# EAGLE design cropdroid-reservoir (EAGLE 9.7.0)
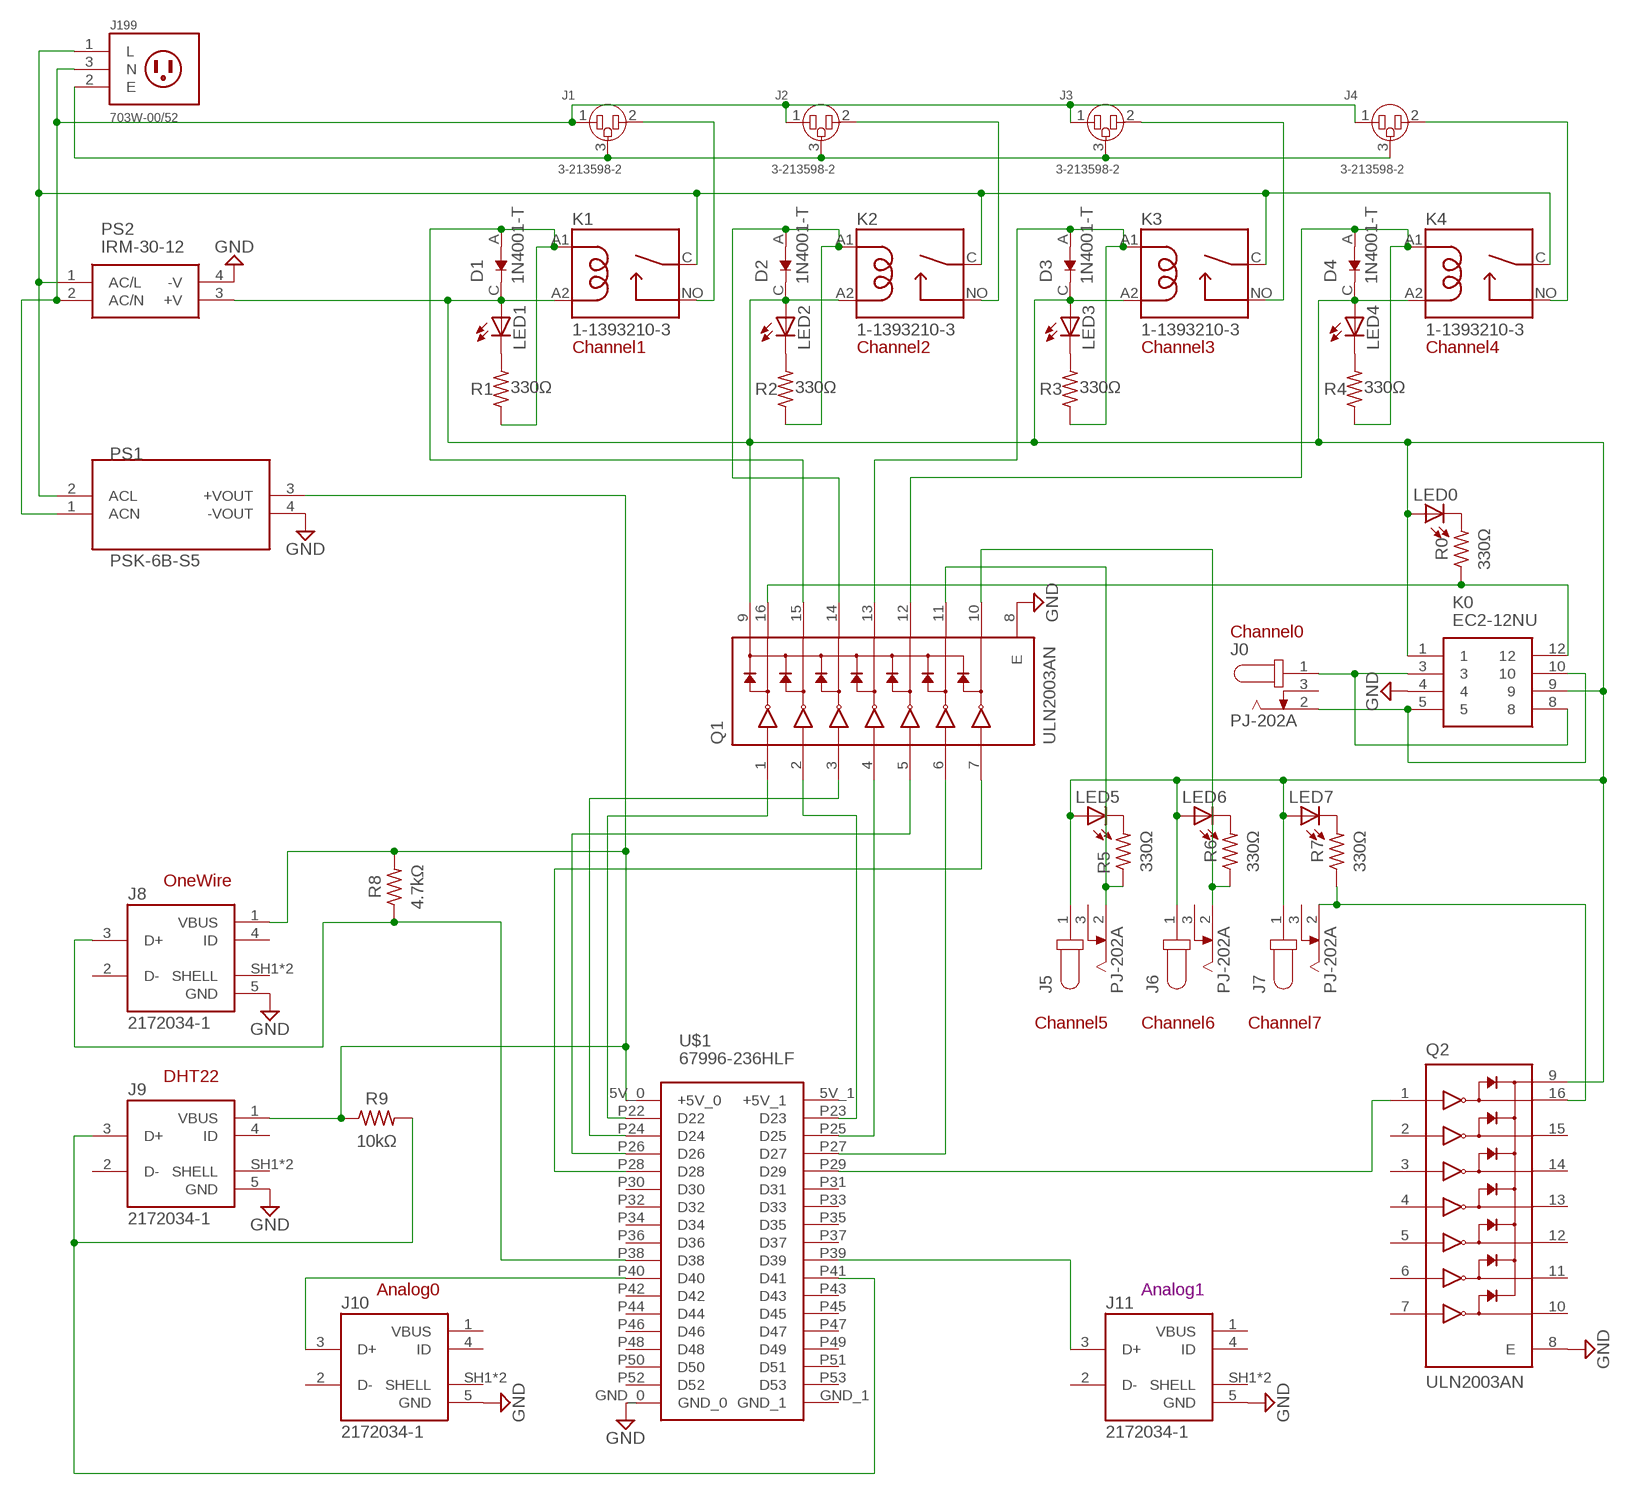
[diagram p0: schematic, sheet 1]

## Parts
D1  1N4001-T  [DIOAD953W69L521D272]
D2  1N4001-T  [DIOAD953W69L521D272]
D3  1N4001-T  [DIOAD953W69L521D272]
D4  1N4001-T  [DIOAD953W69L521D272]
J0  PJ-202A  [CUI_PJ-202A]
J1  3-213598-2  [TE_3-213598-2]
J2  3-213598-2  [TE_3-213598-2]
J3  3-213598-2  [TE_3-213598-2]
J4  3-213598-2  [TE_3-213598-2]
J5  PJ-202A  [CUI_PJ-202A]
J6  PJ-202A  [CUI_PJ-202A]
J7  PJ-202A  [CUI_PJ-202A]
J8  2172034-1  [TE_2172034-1]
J9  2172034-1  [TE_2172034-1]
J10  2172034-1  [TE_2172034-1]
J11  2172034-1  [TE_2172034-1]
J199  703W-00/52  [QUALTEK_703W-00/52]
K0  EC2-12NU  [EC2-12NU]
K1  1-1393210-3  [TE_1-1393210-3]
K2  1-1393210-3  [TE_1-1393210-3]
K3  1-1393210-3  [TE_1-1393210-3]
K4  1-1393210-3  [TE_1-1393210-3]
LED0  LED3MM  [LED3MM]
LED1  LED3MM  [LED3MM]
LED2  LED3MM  [LED3MM]
LED3  LED3MM  [LED3MM]
LED4  LED3MM  [LED3MM]
LED5  LED3MM  [LED3MM]
LED6  LED3MM  [LED3MM]
LED7  LED3MM  [LED3MM]
PS1  PSK-6B-S5  [CONV_PSK-6B-S5]
PS2  IRM-30-12  [IRM3048]
Q1  ULN2003AN  [DIP794W45P254L1969H508Q16]
Q2  ULN2003AN  [DIP794W45P254L1969H508Q16]
R0  330Ω  R-US_AXIAL-7.2MM-PITCH  [RESAD724W46L381D178B]
R1  330Ω  R-US_AXIAL-7.2MM-PITCH  [RESAD724W46L381D178B]
R2  330Ω  R-US_AXIAL-7.2MM-PITCH  [RESAD724W46L381D178B]
R3  330Ω  R-US_AXIAL-7.2MM-PITCH  [RESAD724W46L381D178B]
R4  330Ω  R-US_AXIAL-7.2MM-PITCH  [RESAD724W46L381D178B]
R5  330Ω  R-US_AXIAL-7.2MM-PITCH  [RESAD724W46L381D178B]
R6  330Ω  R-US_AXIAL-7.2MM-PITCH  [RESAD724W46L381D178B]
R7  330Ω  R-US_AXIAL-7.2MM-PITCH  [RESAD724W46L381D178B]
R8  4.7kΩ  R-US_AXIAL-7.2MM-PITCH  [RESAD724W46L381D178B]
R9  10kΩ  R-US_AXIAL-7.2MM-PITCH  [RESAD724W46L381D178B]
U$1  67996-236HLF  [67996-236HLF]

## Nets
GND: J8.5(GND) J9.5(GND) J10.5(GND) J11.5(GND) K0.4 PS1.4(-VOUT) PS2.4(-V) Q1.8(E) Q2.8(E) U$1.GND_0
N$1 [PowerSupply]: J1.1 J2.1 J3.1 J4.1 J199.3(N) PS1.1(ACN) PS2.2(AC/N)
N$2: K0.12 Q1.16(1C) R0.1
N$3: LED1.K(C) R1.2
N$4: D1.A K1.A1 Q1.15(2C) R1.1
N$5 [MainsAC]: J1.2 K1.NO
N$6: J11.3(D+) U$1.P39(D39)
N$7 [MainsAC]: J1.3 J2.3 J3.3 J4.3 J199.2(E)
N$8: LED2.K(C) R2.2
N$9 [MainsAC]: J2.2 K2.NO
N$10: D2.A K2.A1 Q1.14(3C) R2.1
N$11 [PowerSupply]: D1.C D2.C D3.C D4.C J5.1 J6.1 J7.1 K0.1 K0.9 K1.A2 K2.A2 K3.A2 K4.A2 LED0.A LED1.A LED2.A LED3.A LED4.A LED5.A LED6.A LED7.A PS2.3(+V) Q1.9(COM) Q2.9(COM)
N$12: LED3.K(C) R3.2
N$13: J0.1 K0.3 K0.8
N$14: LED4.K(C) R4.2
N$15: J0.2 K0.5 K0.10
N$16: J5.2 Q1.11(6C) R5.1
N$17: D3.A K3.A1 Q1.13(4C) R3.1
N$18 [MainsAC]: J3.2 K3.NO
N$19: J6.2 Q1.10(7C) R6.1
N$20: D4.A K4.A1 Q1.12(5C) R4.1
N$21 [MainsAC]: J4.2 K4.NO
N$22: J7.2 Q2.16(1C) R7.1
N$23: Q2.1(1B) U$1.P29(D29)
N$24: Q1.6(6B) U$1.P27(D27)
N$25: Q1.4(4B) U$1.P25(D25)
N$26: Q1.2(2B) U$1.P23(D23)
N$27: J9.3(D+) R9.2 U$1.P41(D41)
N$29 [PowerSupply]: J199.1(L) K1.C K2.C K3.C K4.C PS1.2(ACL) PS2.1(AC/L)
N$30: Q1.1(1B) U$1.P22(D22)
N$31: Q1.3(3B) U$1.P24(D24)
N$32: J8.1(VBUS) J9.1(VBUS) PS1.3(+VOUT) R8.2 R9.1 U$1.5V_0(+5V_0)
N$33: J10.3(D+) U$1.P40(D40)
N$35: Q1.7(7B) U$1.P28(D28)
N$36: Q1.5(5B) U$1.P26(D26)
N$37: J8.3(D+) R8.1 U$1.P38(D38)
N$39: LED5.K(C) R5.2
N$40: LED6.K(C) R6.2
N$41: LED7.K(C) R7.2
N$42: LED0.K(C) R0.2
Unconnected: J0.3 J5.3 J6.3 J7.3 J8.2(D-) J8.4(ID) J9.2(D-) J9.4(ID) J10.2(D-) J10.4(ID) J11.2(D-) J11.4(ID) Q2.2(2B) Q2.3(3B) Q2.4(4B) Q2.5(5B) Q2.6(6B) Q2.7(7B) Q2.10(7C) Q2.11(6C) Q2.12(5C) Q2.13(4C) Q2.14(3C) Q2.15(2C) U$1.5V_1(+5V_1) U$1.GND_1 U$1.P30(D30) U$1.P31(D31) U$1.P32(D32) U$1.P33(D33) U$1.P34(D34) U$1.P35(D35) U$1.P36(D36) U$1.P37(D37) U$1.P42(D42) U$1.P43(D43) U$1.P44(D44) U$1.P45(D45) U$1.P46(D46) U$1.P47(D47) U$1.P48(D48) U$1.P49(D49) U$1.P50(D50) U$1.P51(D51) U$1.P52(D52) U$1.P53(D53)

## Notes on the sheet
- Channel1 | Channel1 | Channel2 | Channel3 | Channel4
- Channel0
- OneWire
- Channel5 | Channel6 | Channel7
- DHT22
- Analog0 | Analog1

## Power pins joined to a net without a drawn wire
SHELL: J8.SH1(SHELL) J8.SH2(SHELL) J9.SH1(SHELL) J9.SH2(SHELL) J10.SH1(SHELL) J10.SH2(SHELL) J11.SH1(SHELL) J11.SH2(SHELL)
VBUS: J10.1(VBUS) J11.1(VBUS)

## Library data of the parts
D1-D4 = 1N4001-T:1N4001-T: Diode, Standard Recovery, 1a, 50v, Do-204al-2, Full Reel Check prices <https://pricing.snapeda.com/parts/1N4001/ON%20Semiconductor/view-part?ref=eda>; AVAILABILITY: In Stock; DESCRIPTION: DIODE; 1 A (MAX.) @ 25C IF; 1.1 V (MAX.) @ 25C; 5 UADC (MAX.) @ 25C IR; MF: ON Semiconductor; MP: 1N4001; PACKAGE: DO-41 HVCA; PRICE: None
J0 J5-J7 = PJ-202A:PJ-202A: 2.0 mm Center Pin, 2.5 A, Right Angle, Through Hole, Kinked Pins, Dc Power Jack Connector Check prices <https://pricing.snapeda.com/parts/PJ-202A/CUI%20Devices/view-part?ref=eda>; AVAILABILITY: In Stock; CUI_PURCHASE_URL: https://www.cuidevices.com/product/interconnect/connectors/dc-power-connectors/jacks/pj-202a?utm_source=snapeda.com&utm_medium=referral&utm_campaign=snapedaBOM; DESCRIPTION: 2.0 x 6.5 mm, 2.5 A, Horizontal, Through Hole, Kinked Pins, Dc Power Jack Connector; MF: CUI Devices; MP: PJ-202A; PACKAGE: None; PRICE: None
J1-J4 = 3-213598-2:3-213598-2: Conn Power RCP 2Power/1Ground POS 12.7mm Solder ST Thru-Hole 3 Terminal 1 Port Check prices <https://pricing.snapeda.com/parts/3-213598-2/TE%20Connectivity/view-part?ref=eda>; AVAILABILITY: In Stock; COMMENT: 3-213598-2; DESCRIPTION: OUTLET ASSEMBLY, 15A, CONVENIENCE; Series:-; Gender:Receptacle; Current Rating:1; EU_ROHS_COMPLIANCE: Compliant; MF: TE Connectivity; MP: 3-213598-2; PACKAGE: None; PRICE: None; PRODUCT_TYPE: Convenience Outlet; PURCHASE-URL: https://pricing.snapeda.com/search/part/3-213598-2/?ref=eda
J8-J11 = 2172034-1:2172034-1: CONN RCPT USB MINI B 2.0 PCB R/A Check prices <https://pricing.snapeda.com/parts/2172034-1/TE%20Connectivity/view-part?ref=eda>; AVAILABILITY: In Stock; COMMENT: 2172034-1; DESCRIPTION: Conn Mini USB Type B RCP 5 POS 0.8mm Solder RA Thru-Hole 5 Terminal 1 Port Box/Tray; EU_ROHS_COMPLIANCE: Compliant; MF: TE Connectivity; MP: 2172034-1; PACKAGE: None; PRICE: None; PURCHASE-URL: https://pricing.snapeda.com/search/part/2172034-1/?ref=eda
J199 = 703W-00_52:703W-00/52: 3 Position 250 V 10 A Male Pins AC Receptacle Right Angle Connector Check prices <https://pricing.snapeda.com/parts/703W-00/52/Qualtek/view-part?ref=eda>; AVAILABILITY: In Stock; DESCRIPTION: Power Entry Connector Receptacle, Male Blades IEC 320-C14 Panel Mount, Flange; Through Hole, Right Angle; MF: Qualtek; MP: 703W-00/52; PACKAGE: None; PRICE: None
K0 = EC2-12NU:EC2-12NU: DPDT PCB Mount Non-Latching Relay 2 A, 12V dc Source: Datasheet; DESCRIPTION: DPDT PCB Mount Non-Latching Relay 2 A, 12V dc; HEIGHT: mm; MANUFACTURER_NAME: Kemet; MANUFACTURER_PART_NUMBER: EC2-12NU; MOUSER_PART_NUMBER: 80-EC2-12NU; MOUSER_PRICE-STOCK: https://www.mouser.co.uk/ProductDetail/KEMET/EC2-12NU?qs=BenOyfdfArqRFl%252BOm5Bdvw%3D%3D
K1-K4 = 1-1393210-3:1-1393210-3: Electromechanical Relay 12VDC 144Ohm 30A SPST-NO (( 32.51mm 27.43mm 20.4mm)) THT Industrial Relay Check prices <https://pricing.snapeda.com/parts/T9AS1D12-12/TE%20Connectivity/view-part?ref=eda>; AVAILABILITY: In Stock; COMMENT: 1-1393210-3; DESCRIPTION: Electromechanical Relay 12VDC 144Ohm 30A SPST-NO (( 32.51mm 27.43mm 20.4mm)) THT Industrial Relay; MF: TE Connectivity; MP: T9AS1D12-12; PACKAGE: None; PRICE: None; PURCHASE-URL: https://pricing.snapeda.com/search/part/T9AS1D12-12/?ref=eda
LED0 LED1-LED7 = adafruit:LED: LED OSRAM: - CHIPLED LG R971, LG N971, LY N971, LG Q971, LY Q971, LO R971, LY R971 LH N974, LH R974 LS Q976, LO Q976, LY Q976 LO Q996 - Hyper CHIPLED LW Q18S LB Q993, LB Q99A, LB R99A - SideLED LS A670, LO A670, LY A670, LG A670, LP A670 LB A673, LV A673, LT A673, LW A673 LH A674 LY A675 LS A676, LA A676, LO A676, LY A676, LW A676 LS A679, LY A679, LG A679 - Hyper Micro SIDELED® LS Y876, LA Y876, LO Y876, LY Y876 LT Y87S - SmartLED LW L88C, LW L88S LB L89C, LB L89S, LG L890 LS L89K, LO L89K, LY L89K LS L896, LA L896, LO L896, LY L896 - TOPLED LS T670, LO T670, LY T670, LG T670, LP T670 LSG T670, LSP T670, LSY T670, LOP T670, LYG T670 LG T671, LOG T671, LSG T671 LB T673, LV T673, LT T673, LW T673 LH T674 LS T676, LA T676, LO T676, LY T676, LB T676, LH T676, LSB T676, LW T676 LB T67C, LV T67C, LT T67C, LS T67K, LO T67K, LY T67K, LW E67C LS E67B, LA E67B, LO E67B, LY E67B, LB E67C, LV E67C, LT E67C LW T67C LS T679, LY T679, LG T679 LS T770, LO T770, LY T770, LG T770, LP T770 LB T773, LV T773, LT T773, LW T773 LH T774 LS E675, LA E675, LY E675, LS T675 LS T776, LA T776, LO T776, LY T776, LB T776 LHGB T686 LT T68C, LB T68C - Hyper Mini TOPLED® LB M676 - Mini TOPLED Santana® LG M470 LS M47K, LO M47K, LY M47K Source: http://www.osram.convergy.de/
PS1 = PSK-6B-S5:PSK-6B-S5: Check prices <https://pricing.snapeda.com/parts/PSK-6B-S5/CUI%20Inc./view-part?ref=eda>; AVAILABILITY: In Stock; CUI_PURCHASE_URL: https://www.cui.com/product/internal-ac-dc-power-supplies/board-mount/psk-6b-series?utm_source=snapeda.com&utm_medium=referral&utm_campaign=snapedaBOM; DESCRIPTION: 6 W, 85 ~ 264 Vac Input, Single Output, Encapsulated, Board Mount, Ac-Dc Power Supply; MF: CUI Inc.; MP: PSK-6B-S5; PACKAGE: DIP-4 CUI; PRICE: None
PS2 = IRM-30-12:IRM-30-12: Power Supply Encapsulated PCB 12V 30W Source: Datasheet <http://www.meanwell.com/Upload/PDF/IRM-30/IRM-30-SPEC.PDF>; ARROW_PART_NUMBER: IRM-30-12; ARROW_PRICE-STOCK: https://www.arrow.com/en/products/irm-30-12/mean-well-enterprises; DESCRIPTION: Power Supply Encapsulated PCB 12V 30W; HEIGHT: 24mm; MANUFACTURER_NAME: Mean Well; MANUFACTURER_PART_NUMBER: IRM-30-12; MOUSER_PART_NUMBER: 709-IRM30-12; MOUSER_PRICE-STOCK: https://www.mouser.co.uk/ProductDetail/MEAN-WELL/IRM-30-12?qs=Ubm%252Bqu3%2FQAv0qUuIjQjetQ%3D%3D
Q1 Q2 = ULN2003AN:ULN2003AN: Check prices <https://pricing.snapeda.com/parts/ULN2003AN/Texas%20Instruments/view-part?ref=eda>; AVAILABILITY: In Stock; DESCRIPTION: 50-V, 7-ch darlington transistor array, -20C to 70C 16-PDIP -40 to 70; MF: Texas Instruments; MP: ULN2003AN; PACKAGE: PDIP-16 Texas Instruments; PRICE: None; PURCHASE-URL: https://pricing.snapeda.com/search/part/ULN2003AN/?ref=eda
R0 R1-R9 = Resistor:R-US: Resistor Fixed - ANSI; CATEGORY: Resistor; SUB-CATEGORY: Fixed
U$1 = 67996-236HLF:67996-236HLF

## Net classes
1 MainsAC: width 6.299 mm, drill 0.381 mm, clearance 0.6 mm
2 PowerSupply: width 0.711 mm, drill 0.381 mm, clearance 0.254 mm

## Board
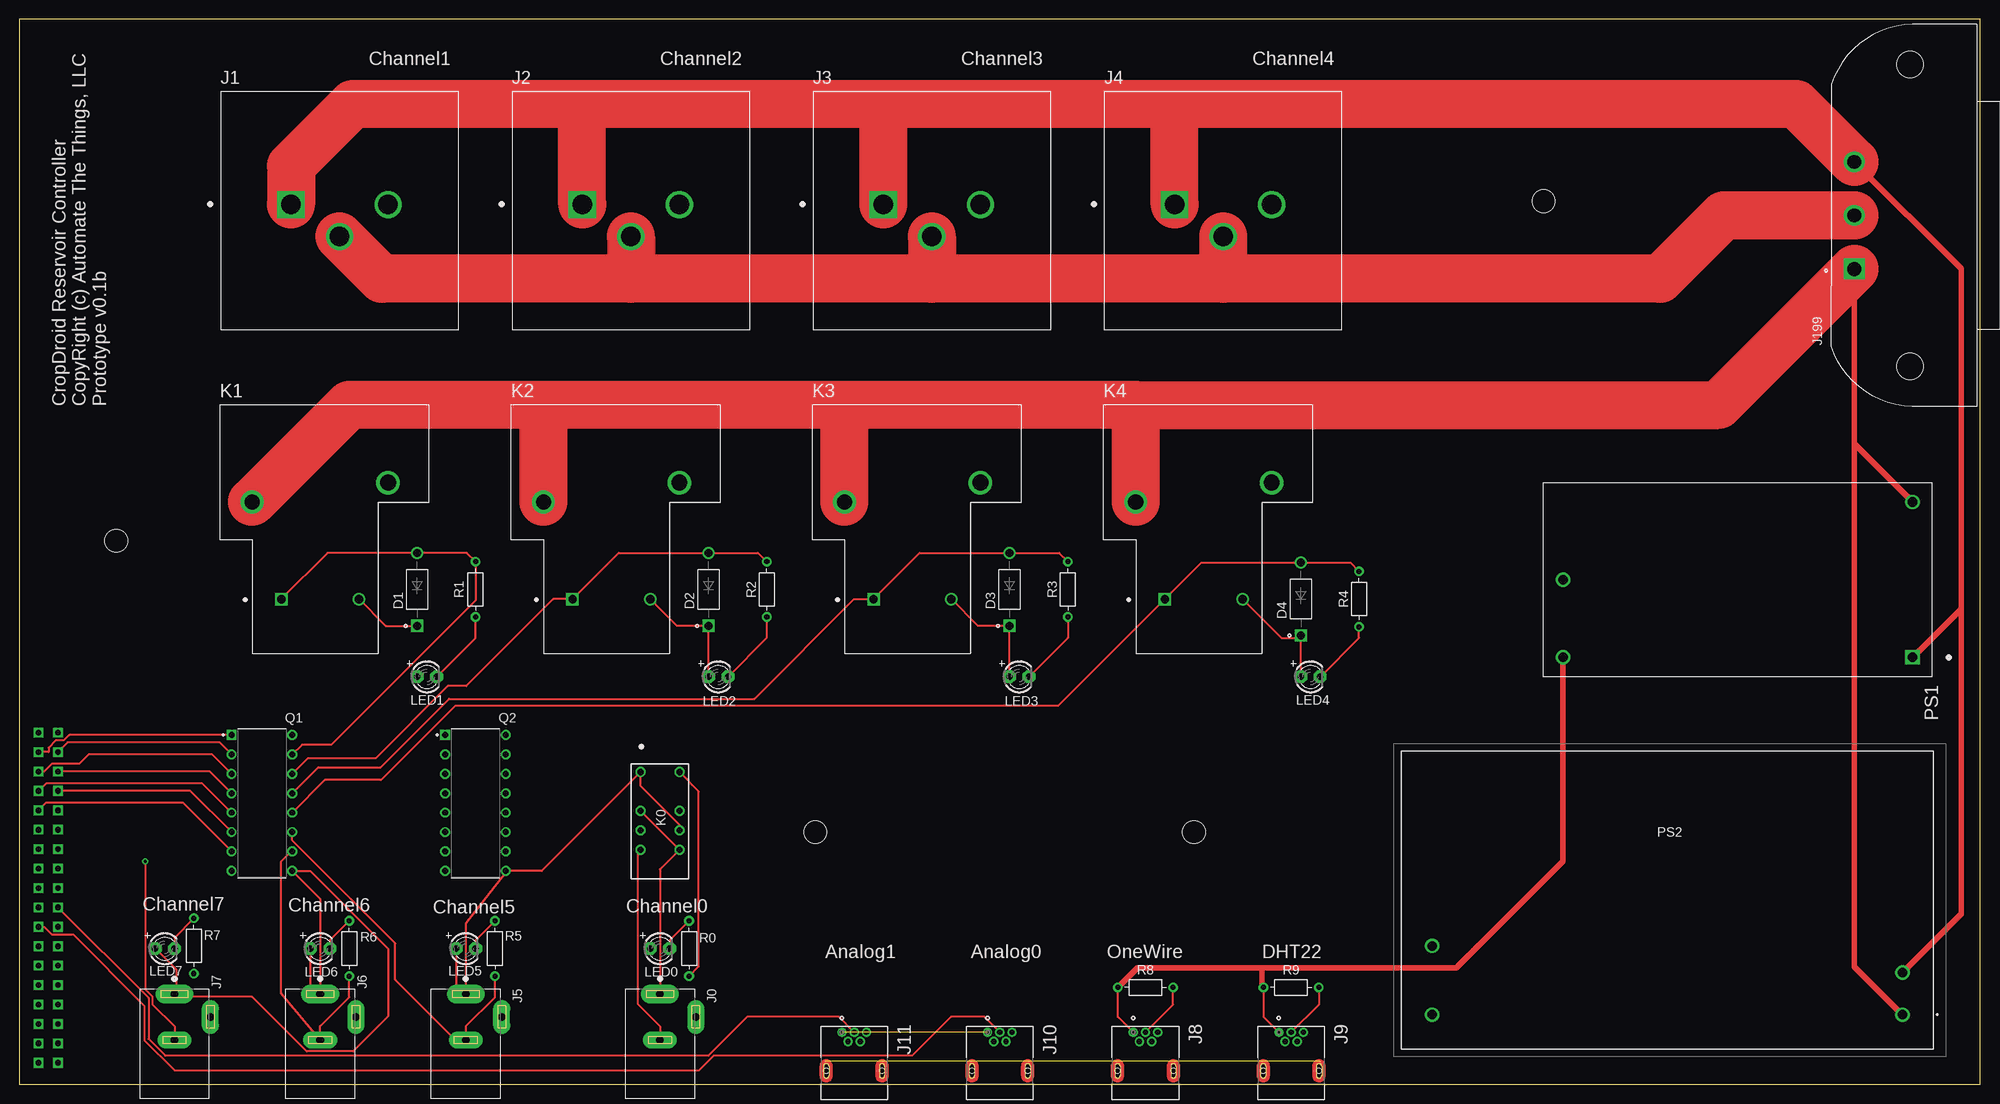
[diagram p1: board, top side]
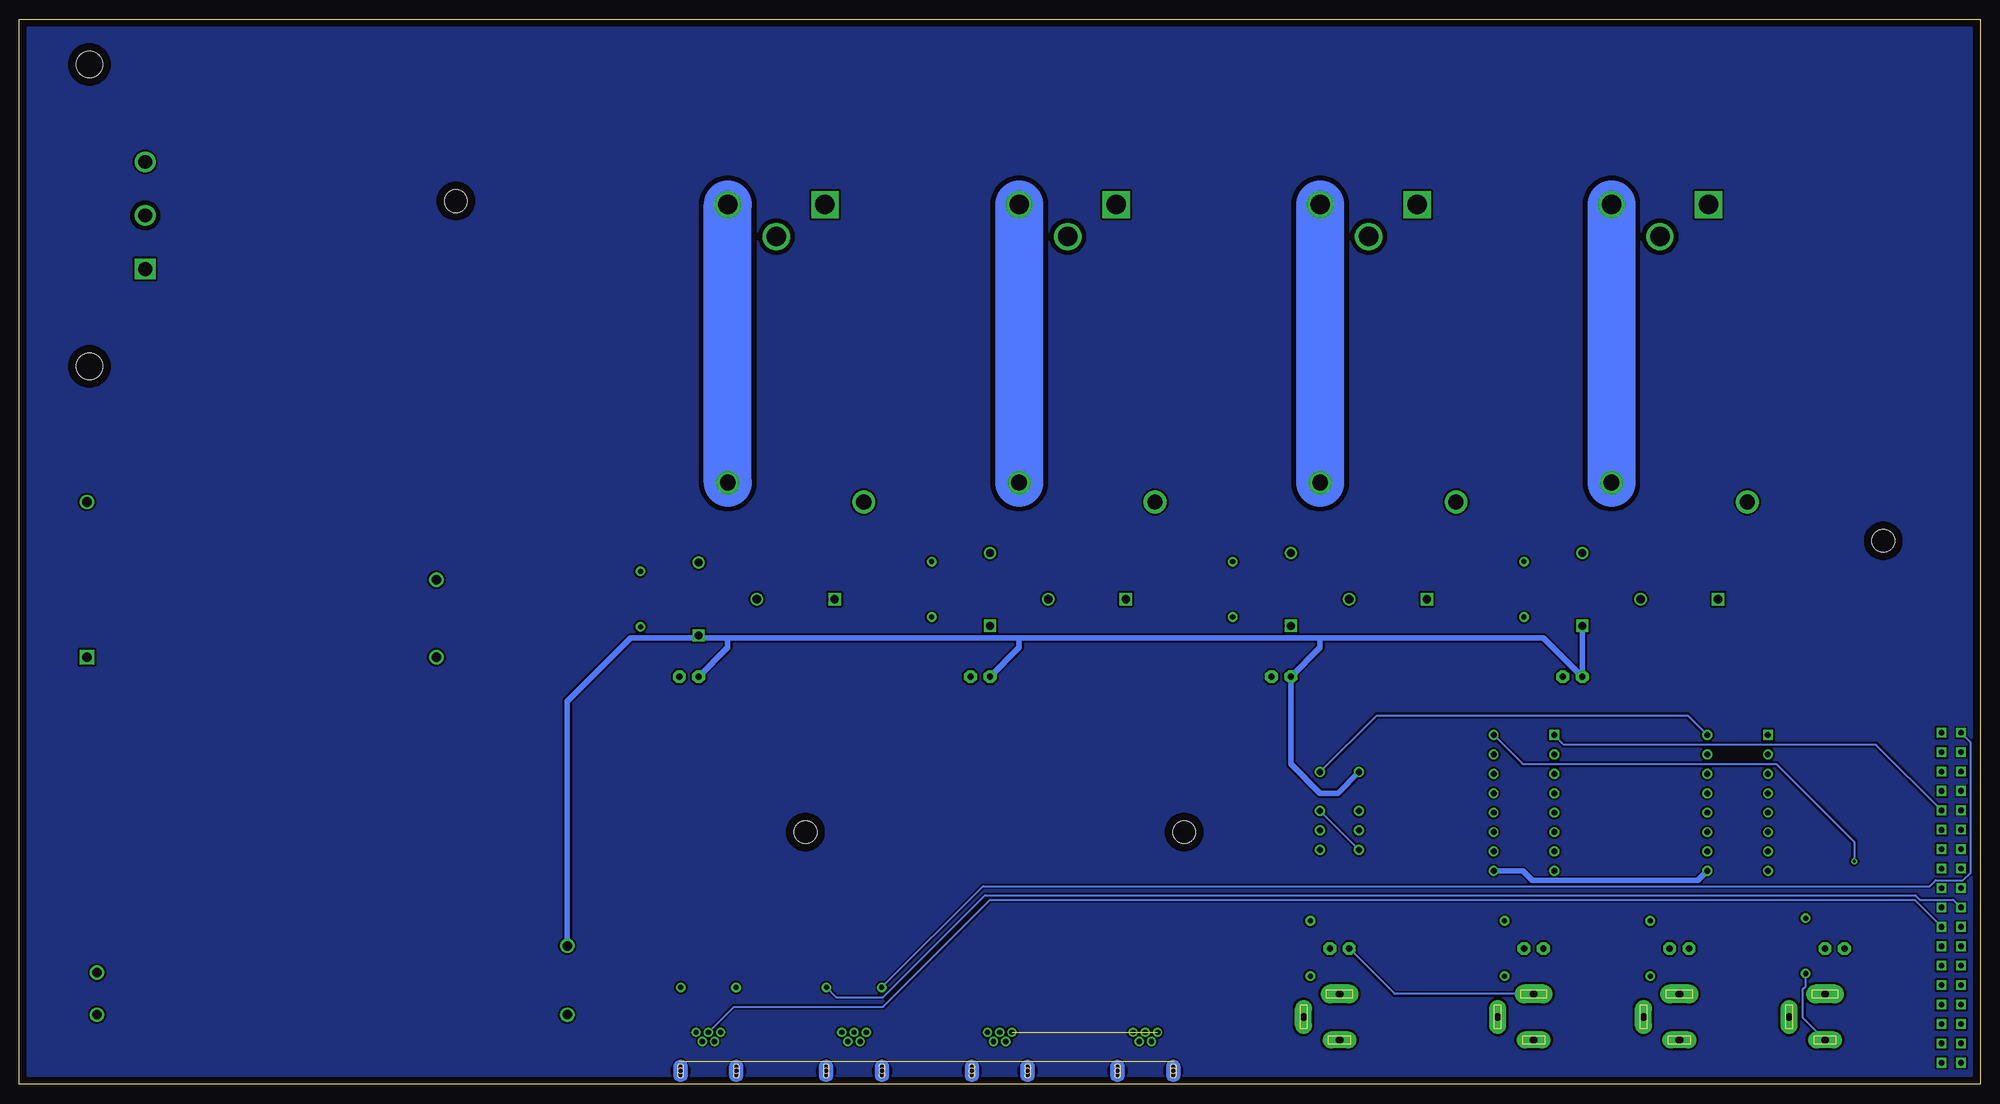
[diagram p2: board, bottom side, seen from below]

Size 256.52 x 139.37 mm. Coordinates in mm from the lower left corner, seen from the top.
Outline: 0,0 256.52,0 256.52,139.37 0,139.37 0,0
Copper layers (1*16): Top / Bottom
Stack-up Default Layer Stack: Top User Defined 0.035mm / Dielectric-1 User Defined 1.5mm / Bottom User Defined 0.035mm
Design rules: minimum copper width class=1 248mil, minimum copper width class=2 28mil, minimum copper width 10mil, minimum drill size class=1 15mil, minimum drill size class=2 15mil, minimum drill size 0.35mm, copper clearance class=1 to class=1 0.6mm, copper clearance class=2 to class=2 10mil, copper clearance wire_polygon to wire_polygon 10mil, copper clearance wire_polygon to pad_smd 10mil, copper clearance wire_polygon to via 10mil, copper clearance pad_smd to pad_smd 10mil, copper clearance pad_smd to via 10mil, copper clearance via to via 10mil, copper clearance smd to pad (same net) 6mil, copper clearance smd to via (same net) 6mil, copper clearance smd to smd (same net) 6mil, dimension clearance 40mil, via restrict clearance 0mil, restrict clearance 0mil, drill distance 6mil, keepout clearance 0mil
Holes 3 mm at 199.39,115.57 153.67,33.02 104.14,33.02 12.7,71.12

### Footprints (pad centres in the part's own frame; a part is rotated, then mirrored left to right if it is on the bottom)
DIOAD953W69L521D272 = drill 1.06 pad 1.59: A 4.765,0 | drill 1.06 pad 1.59 square: C -4.765,0
CUI_PJ-202A = drill 1 pad 2.5 long: 1 -6.5,0 | drill 1 pad 2.25 long: 2 -0.5,0; 3 -3.5,4.7
TE_3-213598-2 = drill 2.54 square: 1 -6.35,0.81 | drill 2.54: 2 6.35,0.81; 3 0,-3.38
TE_2172034-1 = drill 0.7: 1 -5.05,-1.6; 2 -3.85,-0.8; 3 -5.05,0; 4 -3.85,0.8; 5 -5.05,1.6 | smd 0.1 x 0.1: SH1 -1.27,3.81; SH2 -1.27,-3.81 | hole 0.7: 0,3.65; 0,-3.65
QUALTEK_703W-00/52 = drill 1.8 square: 1 0,0 | drill 1.8: 2 7,0; 3 14,0 | hole 3.5: 26.75,-7.3; -12.75,-7.3
EC2-12NU = drill 0.8 pad 1.3: 1 1.05,-2.54; 3 6.13,-2.54; 4 8.67,-2.54; 5 11.21,-2.54; 8 11.21,2.54; 9 8.67,2.54; 10 6.13,2.54; 12 1.05,2.54
TE_1-1393210-3 = drill 1.09 square: A1 0,0 | drill 1.09: A2 10.16,0 | drill 1.98: C -3.81,12.7 | drill 2.06: NO 13.97,15.24
LED3MM = drill 0.813 pad 1.676 octagon: A -1.27,0; K 1.27,0
CONV_PSK-6B-S5 = drill 1.254 square: 1 -22.86,10.16 | drill 1.254: 2 -22.86,-10.16; 3 22.86,10.16; 4 22.86,0
IRM3048 = drill 1.24 pad 1.86: 1 -30.425,15; 2 -30.425,9.5; 3 31.075,6; 4 31.075,15
DIP794W45P254L1969H508Q16 = drill 0.78 pad 1.13 square: 1 -3.97,8.89 | drill 0.78 pad 1.13: 2 -3.97,6.35; 3 -3.97,3.81; 4 -3.97,1.27; 5 -3.97,-1.27; 6 -3.97,-3.81; 7 -3.97,-6.35; 8 -3.97,-8.89; 9 3.97,-8.89; 10 3.97,-6.35; 11 3.97,-3.81; 12 3.97,-1.27; 13 3.97,1.27; 14 3.97,3.81; 15 3.97,6.35; 16 3.97,8.89
RESAD724W46L381D178B = drill 0.66 pad 1.26: 1 -3.62,0; 2 3.62,0
67996-236HLF = drill 0.75 square: 5V_0 -1.27,20.32; 5V_1 1.27,20.32; GND_0 -1.27,-22.86; GND_1 1.27,-22.86; P22 -1.27,17.78; P23 1.27,17.78; P24 -1.27,15.24; P25 1.27,15.24; P26 -1.27,12.7; P27 1.27,12.7; P28 -1.27,10.16; P29 1.27,10.16; P30 -1.27,7.62; P31 1.27,7.62; P32 -1.27,5.08; P33 1.27,5.08; P34 -1.27,2.54; P35 1.27,2.54; P36 -1.27,0; P37 1.27,0; P38 -1.27,-2.54; P39 1.27,-2.54; P40 -1.27,-5.08; P41 1.27,-5.08; P42 -1.27,-7.62; P43 1.27,-7.62; P44 -1.27,-10.16; P45 1.27,-10.16; P46 -1.27,-12.7; P47 1.27,-12.7; P48 -1.27,-15.24; P49 1.27,-15.24; P50 -1.27,-17.78; P51 1.27,-17.78; P52 -1.27,-20.32; P53 1.27,-20.32

### Placement (x,y rotation side)
D1  52.07,64.77 90 top
D2  90.17,64.77 90 top
D3  129.54,64.77 90 top
D4  167.64,63.5 90 top
J0  83.82,5.33 270 top
J1  41.91,114.3 0 top
J2  80.01,114.3 0 top
J3  119.38,114.3 0 top
J4  157.48,114.3 0 top
J5  58.42,5.33 270 top
J6  39.37,5.33 270 top
J7  20.32,5.33 270 top
J8  147.32,1.78 270 top
J9  166.37,1.78 270 top
J10  128.27,1.78 270 top
J11  109.22,1.78 270 top
J199  240.03,106.68 90 top
K0  83.82,41.91 270 top
K1  34.29,63.5 0 top
K2  72.39,63.5 0 top
K3  111.76,63.5 0 top
K4  149.86,63.5 0 top
LED0  83.82,17.78 0 top
LED1  53.34,53.34 0 top
LED2  91.44,53.34 0 top
LED3  130.81,53.34 0 top
LED4  168.91,53.34 0 top
LED5  58.42,17.78 0 top
LED6  39.37,17.78 0 top
LED7  19.05,17.78 0 top
PS1  224.79,66.04 180 top
PS2  215.9,24.13 180 top
Q1  31.75,36.83 0 top
Q2  59.69,36.83 0 top
R0  87.63,17.78 90 top
R1  59.69,64.77 270 top
R2  97.79,64.77 270 top
R3  137.16,64.77 270 top
R4  175.26,63.5 270 top
R5  62.23,17.78 90 top
R6  43.18,17.78 90 top
R7  22.86,18.13 90 top
R8  147.32,12.7 180 top
R9  166.37,12.7 0 top
U$1  3.81,25.7 0 top

### Tracks (layer width: path | path; a pad name or v marks a point on that pad's centre or on a via)
GND
  pour Bottom: 0,139.37 0,0 256.52,0 256.52,139.37
N$1
  Top 0.711: J199.3 254,106.71 254,62.23 | PS1.1 254,62.23 | 254,62.23 254,22.3 PS2.2
  Top 6.299: J199.3 232.44,128.27 151.13,128.27 | 151.13,128.27 113.03,128.27 | 113.03,128.27 73.66,128.27 | 73.66,128.27 43.64,128.27 35.56,120.19 J1.1 | J2.1 73.66,128.27 | J3.1 113.03,128.27 | J4.1 151.13,128.27
N$2
  Top 0.254: R0.1 88.9,15.43 88.9,38.32 K0.12
  Bottom 0.254: Q1.16 38.26,48.26 78.96,48.26 K0.12
N$3
  Top 0.254: LED1.K 59.69,58.42 R1.2
N$4
  Top 0.254: K1.A1 40.33,69.53 D1.A 58.55,69.53 R1.1 59.69,63.34 40.8,44.45 36.99,44.45 Q1.15
N$5
  Bottom 6.299: J1.2 K1.NO
N$6
  Top 0.254: U$1.P39 16.93,11.31 16.93,5.97 19.08,3.82 90.18,3.82 95.25,8.89 107.16,8.89 J11.3
N$7
  Top 6.299: J199.2 222.9,113.68 214.63,105.41 157.48,105.41 | 157.48,105.41 119.38,105.41 | 119.38,105.41 80.01,105.41 | 80.01,105.41 47.42,105.41 J1.3 | J2.3 80.01,105.41 | J3.3 119.38,105.41 | J4.3 157.48,105.41
N$8
  Top 0.254: LED2.K 97.79,58.42 R2.2
N$9
  Bottom 6.299: J2.2 K2.NO
N$10
  Top 0.254: R2.1 96.64,69.53 D2.A 78.42,69.53 K2.A1 69.85,63.5 58.48,52.13 56.06,52.13 46.6,42.67 37.75,42.67 Q1.14
N$11
  Top 0.254: LED4.A 167.64,58.42 | 167.64,58.42 D4.C | K4.A2 165.1,58.42 167.64,58.42 | LED3.A D3.C 125.42,60 K3.A2 | LED2.A D2.C 86.05,60 K2.A2 | K0.9 86.36,33.99 81.28,39.07 K0.1 68.36,27.94 Q2.9 63.66,27.74 58.42,21.09 J5.1 57.15,13.1 LED5.A | D1.C 47.94,60 K1.A2 | 20.52,11.63 20.69,11.46 30.48,11.46 37.62,4.33 43.7,4.33 48.26,8.89 48.26,17.75 38.07,27.94 Q1.9 39.37,24.29 J6.1 38.1,13.1 LED6.A | 20.52,11.63 J7.1 | LED7.A 20.52,15.04 20.52,11.63
  Bottom 0.254: J5.1 76.6,11.83 LED0.A
  Bottom 0.711: PS2.3 184.82,50.12 176.53,58.42 163.83,58.42 | 163.83,58.42 125.73,58.42 | 125.73,58.42 86.36,58.42 | 86.36,58.42 57.15,58.42 LED1.A D1.C | 125.73,58.42 125.73,57.15 LED3.A | 86.36,58.42 86.36,57.15 LED2.A 90.17,41.91 86.36,38.1 84.04,38.1 K0.1 | 163.83,58.42 163.83,57.15 LED4.A | Q2.9 59.85,27.94 58.6,26.69 36.97,26.69 Q1.9
N$12
  Top 0.254: R3.2 137.16,58.42 LED3.K
N$13
  Top 0.254: K0.3 K0.8 83.82,28.16 J0.1
N$14
  Top 0.254: LED4.K 175.26,58.42 R4.2
N$15
  Top 0.254: K0.5 80.94,30.36 80.94,10.5 83.82,7.62 J0.2
  Bottom 0.254: K0.5 K0.10
N$16
  Top 0.254: R5.1 62.23,11.43 58.42,7.62 J5.2 57.05,5.83 49.19,13.7 49.19,18.46 35.72,31.93 Q1.11
N$17
  Top 0.254: R3.1 136.01,69.53 D3.A 117.8,69.53 K3.A1 109.22,63.5 96.17,50.45 56.23,50.45 47.28,41.5 39.12,41.5 Q1.13
N$18
  Bottom 6.299: J3.2 K3.NO
N$19
  Top 0.254: Q1.10 35.56,30.48 34.29,29.21 34.29,11.95 J6.2 39.37,7.62 43.18,11.43 R6.1
N$20
  Top 0.254: R4.1 174.12,68.27 D4.A 154.62,68.27 K4.A1 135.89,49.53 57.03,49.53 47.33,39.83 39.99,39.83 Q1.12
N$21
  Bottom 6.299: K4.NO J4.2
N$22  (via drill 0.38)
  Top 0.254: J7.2 20.32,7.62 17.44,10.5 17.44,11.52 16.51,12.45 v16.51,29.21
  Bottom 0.254: Q2.16 59.85,41.91 26.67,41.91 16.51,31.75 v16.51,29.21 | R7.1 22.86,12.85 23.2,12.51 23.2,8.71 J7.2
N$23
  Bottom 0.254: U$1.P29 13.67,44.45 54.45,44.45 Q2.1
N$24
  Top 0.254: U$1.P27 22.4,38.4 Q1.6
N$25
  Top 0.254: U$1.P25 24.94,40.94 Q1.4
N$26
  Top 0.254: U$1.P23 6.35,44.75 26.21,44.75 Q1.2
N$27
  Top 0.254: R9.2 169.99,10.45 J9.3
  Bottom 0.254: J9.3 163.04,10.16 143.51,10.16 129.54,24.13 8.59,24.13 U$1.P41
N$29
  Top 0.711: J199.1 240.03,83.82 | PS1.2 240.03,83.82 | 240.03,83.82 240.03,15.42 PS2.1
  Top 6.299: J199.1 222.25,88.9 146.05,88.9 | 146.05,88.9 107.95,88.9 | 107.95,88.9 68.58,88.9 | 68.58,88.9 43.18,88.9 K1.C | K2.C 68.58,88.9 | K3.C 107.95,88.9 | K4.C 146.05,88.9
N$30
  Top 0.254: U$1.P22 3.85,43.48 3.85,44.04 4.81,45.01 5.87,45.01 6.58,45.72 Q1.1
N$31
  Top 0.254: Q1.3 25.24,43.18 9.12,43.18 7.89,41.95 4.29,41.95 3.28,40.94 U$1.P24
N$32
  Top 0.254: J8.1 143.7,8.85 R8.2 | R9.1 162.75,8.85 J9.1
  Top 0.711: PS1.3 201.93,29.21 187.96,15.24 162.56,15.24 | R8.2 146.24,15.24 162.56,15.24 | R9.1 162.56,12.89 162.56,15.24
  Bottom 0.254: U$1.5V_0 1.27,44.75 1.27,27.71 2.27,26.71 5.87,26.71 6.63,25.95 130.45,25.95 R8.2
N$33
  Top 0.254: U$1.P40 3.28,20.62 4.29,19.61 7.06,19.61 16.38,10.29 16.38,5.77 20.32,1.83 88.91,1.83 90.89,3.81 116.84,3.81 121.92,8.89 126.21,8.89 J10.3
N$35
  Top 0.254: U$1.P28 3.55,36.87 21.39,36.87 Q1.7
N$36
  Top 0.254: U$1.P26 3.55,39.41 23.93,39.41 Q1.5
N$37
  Top 0.254: J8.3 150.94,10.45 R8.1
  Bottom 0.254: R8.1 149.67,11.43 143.51,11.43 130.18,24.76 8.51,24.76 7.91,24.17 3.55,24.17 U$1.P38
N$39
  Top 0.254: R5.2 59.69,18.86 LED5.K
N$40
  Top 0.254: R6.2 40.64,18.86 LED6.K
N$41
  Top 0.254: R7.2 20.32,19.21 LED7.K
N$42
  Top 0.254: R0.2 85.09,18.86 LED0.K
SHELL  (7 unrouted)
VBUS  (1 unrouted)

### Text on the board
tPlace: Channel1 | Channel2 | Channel3 | Channel4 | CropDroid Reservoir Controller / CopyRight (c) Automate The Things, LLC / Prototype v0.1b | Channel7 | Channel6 | Channel5 | Channel0 | Analog1 | Analog0 | OneWire | DHT22